# EAGLE design geiger_01_detect (EAGLE 7.2.0)
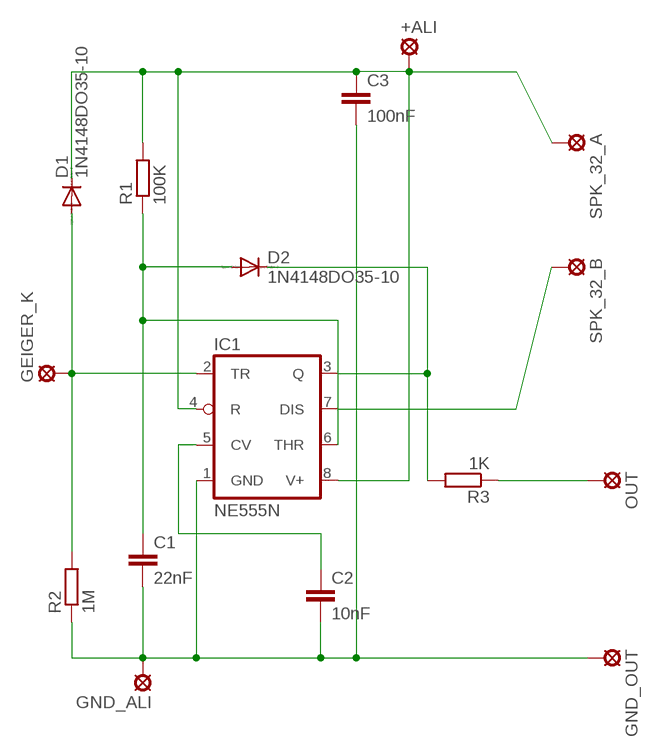
[diagram p0: schematic, sheet 1]

## Parts
+ALI  LSP10  [LSP10]
C1  22nF  C-EU050-025X075  [C050-025X075]
C2  10nF  C-EU050-025X075  [C050-025X075]
C3  100nF  C-EU050-025X075  [C050-025X075]
D1  1N4148DO35-10  [DO35-10]
D2  1N4148DO35-10  [DO35-10]
GEIGER_K  LSP10  [LSP10]
GND_ALI  LSP10  [LSP10]
GND_OUT  LSP10  [LSP10]
IC1  NE555N  [DIL08]
OUT  LSP10  [LSP10]
R1  100K  R-EU_0207/12  [0207/12]
R2  1M  R-EU_0207/12  [0207/12]
R3  1K  R-EU_0207/12  [0207/12]
SPK_32_A  LSP10  [LSP10]
SPK_32_B  LSP10  [LSP10]

## Nets
N$2: OUT.MP R3.1
N$3: C1.1 D2.A IC1.6(THR) R1.1
N$4: +ALI.MP C3.1 D1.C IC1.4(R) IC1.8(V+) R1.2 SPK_32_A.MP
N$5: C2.1 IC1.5(CV)
N$7: C1.2 C2.2 C3.2 GND_ALI.MP GND_OUT.MP IC1.1(GND) R2.1
N$8: D2.C IC1.3(Q) R3.2
N$9: D1.A GEIGER_K.MP IC1.2(TR) R2.2
N$10: IC1.7(DIS) SPK_32_B.MP

## Library data of the parts
+ALI GEIGER_K GND_ALI GND_OUT OUT SPK_32_A SPK_32_B = solpad:LSP10: SOLDER PAD drill 1.0 mm, distributor Buerklin, 12H555
C1-C3 = rcl:C-EU: CAPACITOR, European symbol
D1 D2 = diode:1N4148: DIODE high speed (Philips)
IC1 = linear:*555: TIMER
R1-R3 = rcl:R-EU_: RESISTOR, European symbol

## Board
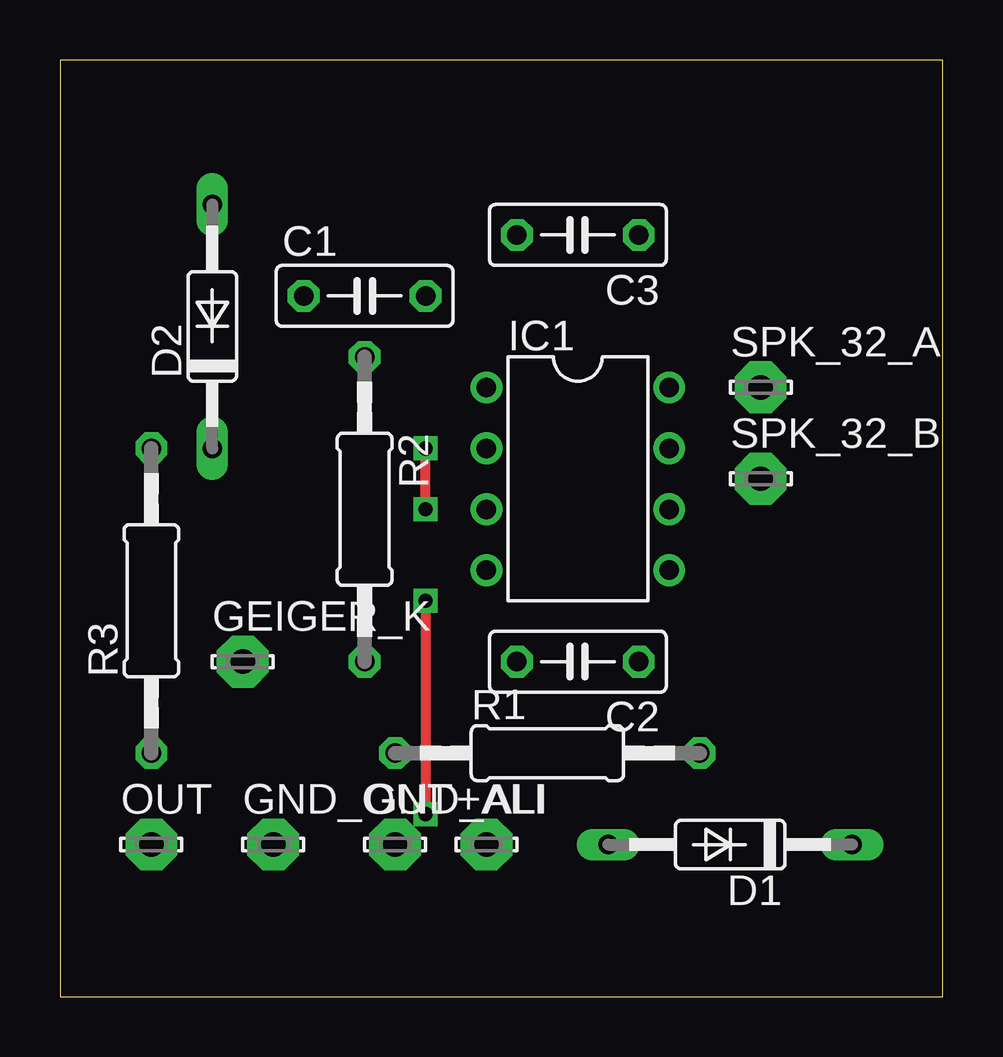
[diagram p1: board, top side]
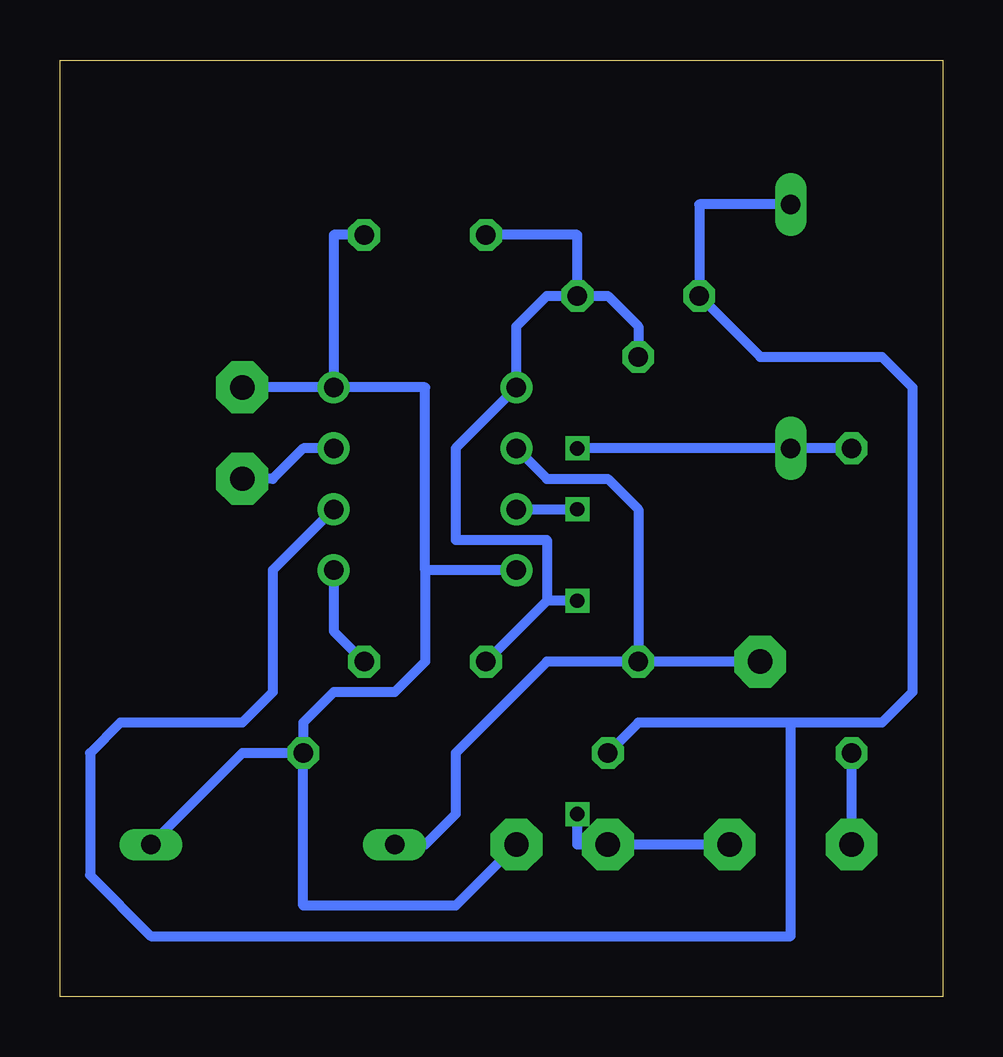
[diagram p2: board, bottom side, seen from below]

Size 36.81 x 39.04 mm. Coordinates in mm from the lower left corner, seen from the top.
Outline: 0,0 36.81,0 36.81,39.04 0,39.04 0,0
Copper layers (1*16): Top 0.035mm / dielectric 1.5mm / Bottom 0.035mm
Design rules "default": minimum track width 10mil, minimum drill 24mil, track to track 8mil, track to pad 8mil, pad to pad 8mil, via to via 8mil, smd to smd 8mil, copper to edge 40mil, drill to drill 8mil, minimum pad ring 10mil, minimum via ring 8mil, stop-mask expansion 4mil, vias tented up to drill 0mil, thermal gap 10mil

### Footprints (pad centres in the part's own frame; a part is rotated, then mirrored left to right if it is on the bottom)
LSP10 = drill 1.016 pad 2.159 octagon: MP 0,0
C050-025X075 = drill 0.813 octagon: 1 -2.54,0; 2 2.54,0
DO35-10 = drill 0.813 long: A 5.08,0; C -5.08,0
DIL08 = drill 0.813 pad 1.27: 1 -3.81,-3.81; 2 -1.27,-3.81; 3 1.27,-3.81; 4 3.81,-3.81; 5 3.81,3.81; 6 1.27,3.81; 7 -1.27,3.81; 8 -3.81,3.81
0207/12 = drill 0.813 octagon: 1 -6.35,0; 2 6.35,0

### Placement (x,y rotation side)
+ALI  17.78,6.35 0 top
C1  12.7,29.21 0 top
C2  21.59,13.97 180 top
C3  21.59,31.75 180 top
D1  27.94,6.35 180 top
D2  6.35,27.94 90 top
GEIGER_K  7.62,13.97 0 top
GND_ALI  13.97,6.35 0 top
GND_OUT  8.89,6.35 0 top
IC1  21.59,21.59 270 top
OUT  3.81,6.35 0 top
R1  20.32,10.16 0 top
R2  12.7,20.32 270 top
R3  3.81,16.51 90 top
SPK_32_A  29.21,25.4 0 top
SPK_32_B  29.21,21.59 0 top

### Tracks (layer width: path | path; a pad name or v marks a point on that pad's centre or on a via)
N$2
  Bottom 0.406: OUT.MP R3.1
N$3
  Bottom 0.406: D2.A 10.16,33.02 C1.1 7.62,26.67 2.54,26.67 1.27,25.4 1.27,12.7 2.54,11.43 6.35,11.43 | 6.35,11.43 12.7,11.43 R1.1 | IC1.6 27.94,17.78 27.94,12.7 29.21,11.43 34.29,11.43 35.56,10.16 35.56,5.08 33.02,2.54 6.35,2.54 6.35,11.43
N$4
  Bottom 0.406: C3.1 25.4,31.75 IC1.8 | IC1.8 SPK_32_A.MP | IC1.4 21.59,17.78 | 21.59,17.78 21.59,25.4 IC1.8 | R1.2 29.21,10.16 D1.C | +ALI.MP 20.32,3.81 26.67,3.81 R1.2 | 21.59,17.78 21.59,13.97 22.86,12.7 25.4,12.7 26.67,11.43 R1.2
N$5
  Bottom 0.406: IC1.5 25.4,15.24 C2.1
N$7  (via drill 0.6)
  Top 0.406: v15.24,16.51 v15.24,7.62
  Bottom 0.406: C1.2 15.24,31.75 C3.2 | GND_OUT.MP GND_ALI.MP 15.24,6.35 v15.24,7.62 | C1.2 16.51,29.21 17.78,27.94 IC1.1 20.32,22.86 20.32,19.05 16.51,19.05 16.51,16.51 | C1.2 13.97,29.21 12.7,27.94 R2.1 | 16.51,16.51 C2.2 | v15.24,16.51 16.51,16.51
N$8  (via drill 0.6)
  Top 0.406: v15.24,20.32 v15.24,22.86
  Bottom 0.406: R3.2 D2.C v15.24,22.86 | IC1.3 v15.24,20.32
N$9
  Bottom 0.406: GEIGER_K.MP R2.2 | IC1.2 16.51,21.59 13.97,21.59 12.7,20.32 R2.2 | R2.2 16.51,13.97 20.32,10.16 20.32,7.62 21.59,6.35 D1.A
N$10
  Bottom 0.406: IC1.7 26.67,22.86 27.94,21.59 SPK_32_B.MP